# EAGLE design B130 (EAGLE 6.6.0)
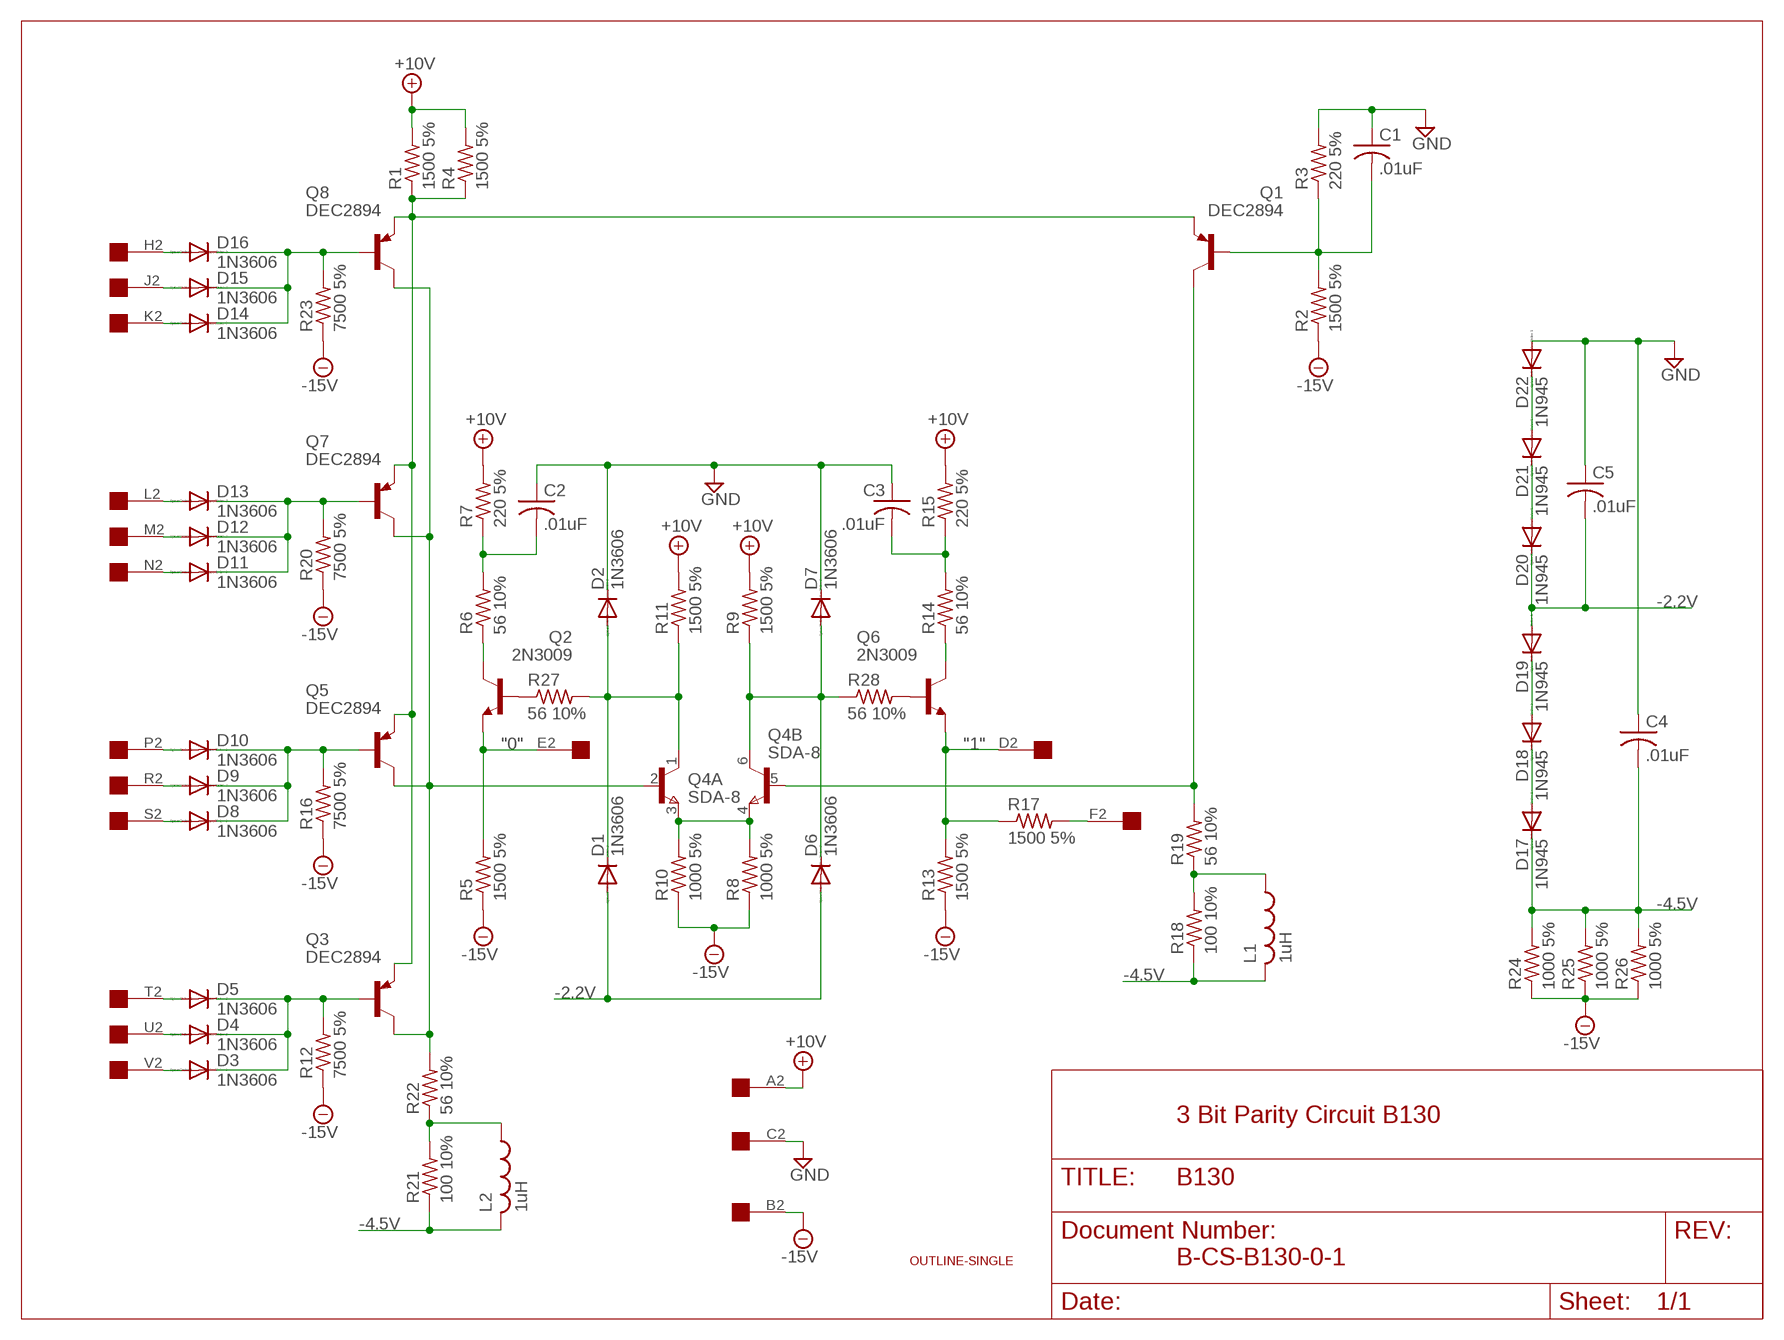
[diagram p0: schematic, sheet 1]

## Parts
C1  .01uF  C-US050-025X075  [C050-025X075]
C2  .01uF  C-US050-025X075  [C050-025X075]
C3  .01uF  C-US050-025X075  [C050-025X075]
C4  .01uF  C-US050-025X075  [C050-025X075]
C5  .01uF  C-US050-025X075  [C050-025X075]
D1  1N3606  1N4148DO35-10  [DO35-10]
D2  1N3606  1N4148DO35-10  [DO35-10]
D3  1N3606  1N4148DO35-10  [DO35-10]
D4  1N3606  1N4148DO35-10  [DO35-10]
D5  1N3606  1N4148DO35-10  [DO35-10]
D6  1N3606  1N4148DO35-10  [DO35-10]
D7  1N3606  1N4148DO35-10  [DO35-10]
D8  1N3606  1N4148DO35-10  [DO35-10]
D9  1N3606  1N4148DO35-10  [DO35-10]
D10  1N3606  1N4148DO35-10  [DO35-10]
D11  1N3606  1N4148DO35-10  [DO35-10]
D12  1N3606  1N4148DO35-10  [DO35-10]
D13  1N3606  1N4148DO35-10  [DO35-10]
D14  1N3606  1N4148DO35-10  [DO35-10]
D15  1N3606  1N4148DO35-10  [DO35-10]
D16  1N3606  1N4148DO35-10  [DO35-10]
D17  1N945  1N4148DO35-10  [DO35-10]
D18  1N945  1N4148DO35-10  [DO35-10]
D19  1N945  1N4148DO35-10  [DO35-10]
D20  1N945  1N4148DO35-10  [DO35-10]
D21  1N945  1N4148DO35-10  [DO35-10]
D22  1N945  1N4148DO35-10  [DO35-10]
L1  1uH  L-US0207/10  [0207/10]
L2  1uH  L-US0207/10  [0207/10]
Q1  DEC2894  2N2904  [TO39]
Q2  2N3009  2N2102  [TO5]
Q3  DEC2894  2N2904  [TO39]
Q4  SDA-8  MAT-02H  [TO78]
Q5  DEC2894  2N2904  [TO39]
Q6  2N3009  2N2102  [TO5]
Q7  DEC2894  2N2904  [TO39]
Q8  DEC2894  2N2904  [TO39]
R1  1500 5%  R-US_0207/10  [0207/10]
R2  1500 5%  R-US_0207/10  [0207/10]
R3  220 5%  R-US_0207/10  [0207/10]
R4  1500 5%  R-US_0207/10  [0207/10]
R5  1500 5%  R-US_0207/10  [0207/10]
R6  56 10%  R-US_0207/10  [0207/10]
R7  220 5%  R-US_0207/10  [0207/10]
R8  1000 5%  R-US_0207/10  [0207/10]
R9  1500 5%  R-US_0207/10  [0207/10]
R10  1000 5%  R-US_0207/10  [0207/10]
R11  1500 5%  R-US_0207/10  [0207/10]
R12  7500 5%  R-US_0207/10  [0207/10]
R13  1500 5%  R-US_0207/10  [0207/10]
R14  56 10%  R-US_0207/10  [0207/10]
R15  220 5%  R-US_0207/10  [0207/10]
R16  7500 5%  R-US_0207/10  [0207/10]
R17  1500 5%  R-US_0207/10  [0207/10]
R18  100 10%  R-US_0207/10  [0207/10]
R19  56 10%  R-US_0207/10  [0207/10]
R20  7500 5%  R-US_0207/10  [0207/10]
R21  100 10%  R-US_0207/10  [0207/10]
R22  56 10%  R-US_0207/10  [0207/10]
R23  7500 5%  R-US_0207/10  [0207/10]
R24  1000 5%  R-US_0207/10  [0207/10]
R25  1000 5%  R-US_0207/10  [0207/10]
R26  1000 5%  R-US_0207/10  [0207/10]
R27  56 10%  R-US_0207/10  [0207/10]
R28  56 10%  R-US_0207/10  [0207/10]
U$1  OUTLINE-SINGLE  [SINGLE]
U$2  EDGE-1  [EDGE-CON1]

## Nets
"0": Q2.1(E) R5.2 U$2.E2
"1": Q6.1(E) R13.2 R17.1 U$2.D2
+10V: R1.2 R4.2 R7.2 R9.2 R11.2 R15.2 U$2.A2
-2.2V: C5.2 D1.A D6.A D19.A D20.C
-4.5V: C4.2 D17.C L1.2 L2.2 R18.1 R21.1 R24.2 R25.2 R26.2
-15V: R2.1 R5.1 R8.1 R10.1 R12.1 R13.1 R16.1 R20.1 R23.1 R24.1 R25.1 R26.1 U$2.B2
GND [Supply]: C1.1 C2.1 C3.1 C4.1 C5.1 D2.C D7.C D22.A R3.2 U$2.C2
N$1: D16.A U$2.H2
N$2: D18.A D19.C
N$3: D15.A U$2.J2
N$4: D17.A D18.C
N$5: Q1.1(E) Q3.1(E) Q5.1(E) Q7.1(E) Q8.1(E) R1.1 R4.1
N$6: D14.A U$2.K2
N$7: D14.C D15.C D16.C Q8.2(B) R23.2
N$8: D13.A U$2.L2
N$9: D12.A U$2.M2
N$10: L2.1 R21.2 R22.1
N$11: D11.A U$2.N2
N$12: D11.C D12.C D13.C Q7.2(B) R20.2
N$13: D10.A U$2.P2
N$14: D9.A U$2.R2
N$15: D8.A U$2.S2
N$16: D8.C D9.C D10.C Q5.2(B) R16.2
N$17: D5.A U$2.T2
N$18: D4.A U$2.U2
N$19: D3.A U$2.V2
N$20: D3.C D4.C D5.C Q3.2(B) R12.2
N$21: Q3.3(C) Q4.2(A:B) Q5.3(C) Q7.3(C) Q8.3(C) R22.2
N$22: Q4.3(A:E) Q4.4(B:E) R8.2 R10.2
N$23: D1.C D2.A Q4.1(A:C) R11.1 R27.2
N$24: D6.C D7.A Q4.6(B:C) R9.1 R28.1
N$25: Q2.2(B) R27.1
N$26: D21.A D22.C
N$27: D20.A D21.C
N$28: Q6.2(B) R28.2
N$29: Q1.3(C) Q4.5(B:B) R19.2
N$30: C1.2 Q1.2(B) R2.2 R3.1
N$31: R17.2 U$2.F2
N$32: Q6.3(C) R14.1
N$33: Q2.3(C) R6.1
N$34: C2.2 R6.2 R7.1
N$35: C3.2 R14.2 R15.1
N$36: L1.1 R18.2 R19.1

## Notes on the sheet
- 3 Bit Parity Circuit B130
- B-CS-B130-0-1

## Library data of the parts
C1-C5 = rcl:C-US: CAPACITOR, American symbol
D1-D22 = diode:1N4148: DIODE high speed (Philips)
L1 L2 = rcl:L-US: INDUCTOR, American symbol
Q1 Q3 Q5 Q7 Q8 = transistor-pnp:2N2904*: PNP Transistror
Q2 Q6 = transistor-npn:2N2102: NPN Transistor
Q4 = linear:MAT-02H: Dual TRANSISTOR
R1-R28 = rcl:R-US_: RESISTOR, American symbol
U$1 = dec-con:OUTLINE-*: Board outlines for DEC boards.
U$2 = dec-con:EDGE-1: Single-Sided DEC Edge Connector -- (side 2)

## Net classes
1 Supply: width 0.813 mm

## Board
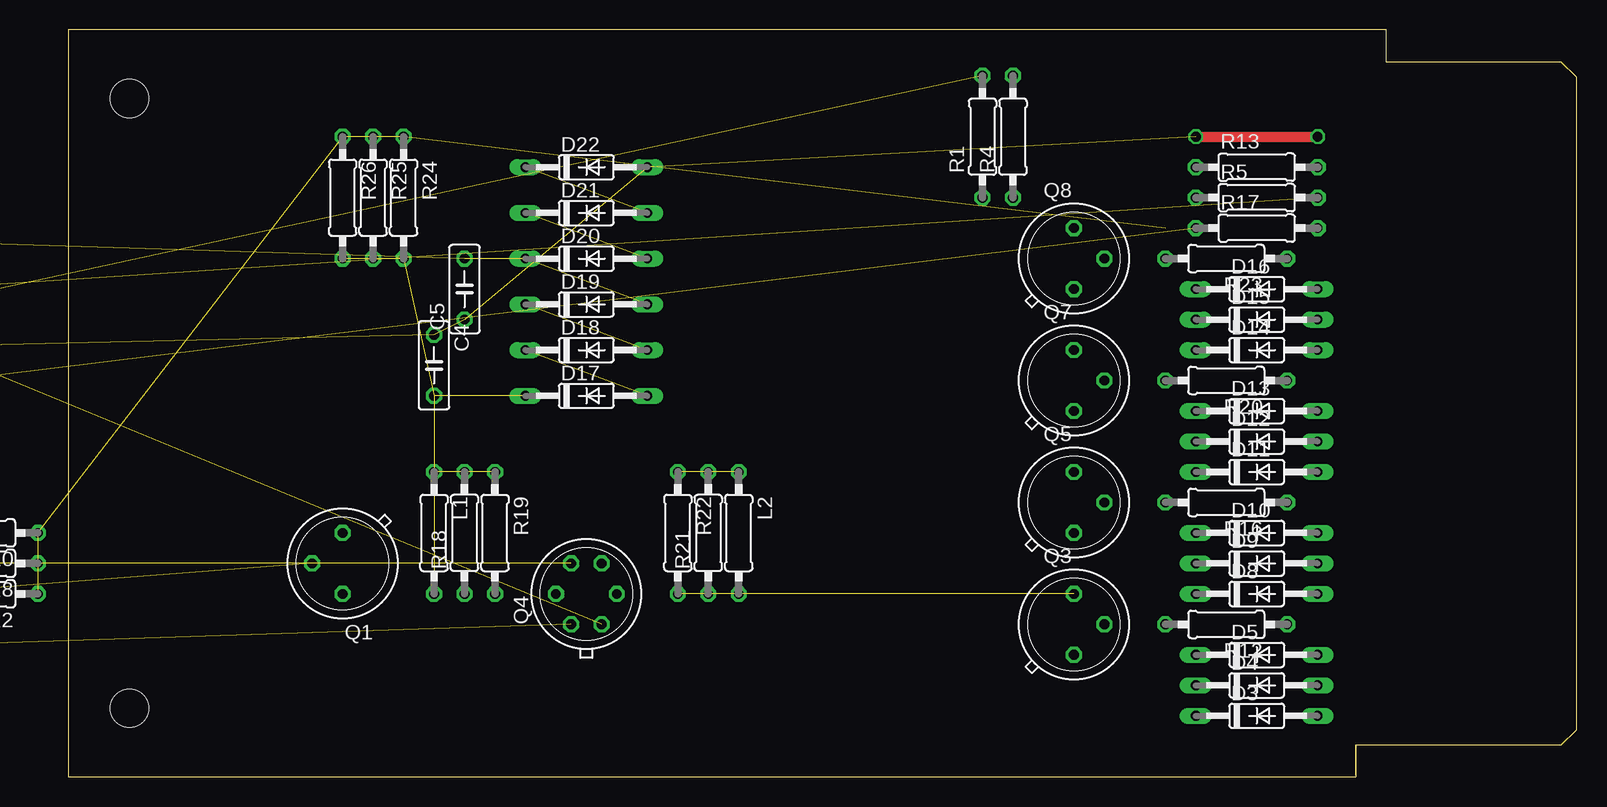
[diagram p1: board, top side]
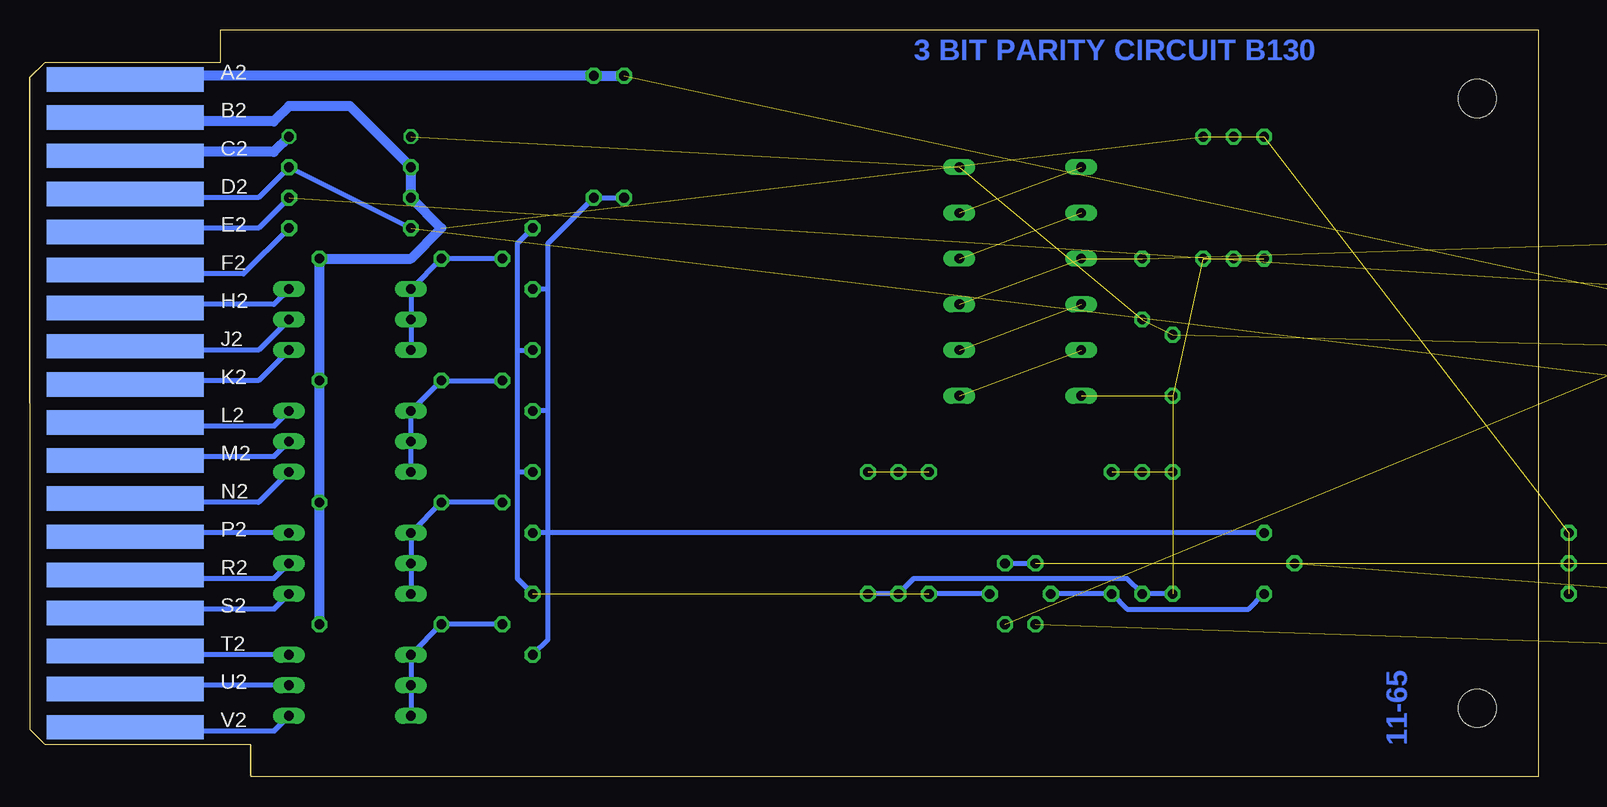
[diagram p2: board, bottom side, seen from below]

Size 125.73 x 62.23 mm. Coordinates in mm from the lower left corner, seen from the top.
Copper layers (1+16): Top 0.035mm / dielectric 1.5mm / Bottom 0.035mm
Design rules "16mils": minimum track width 16mil, minimum drill 32mil, track to track 15mil, track to pad 10mil, pad to pad 10mil, via to via 10mil, smd to smd 10mil, copper to edge 25mil, drill to drill 10mil, minimum pad ring 10mil, minimum via ring 8mil, stop-mask expansion 0mil, vias tented up to drill 0mil, thermal gap 10mil

### Footprints (pad centres in the part's own frame; a part is rotated, then mirrored left to right if it is on the bottom)
C050-025X075 = drill 0.813 octagon: 1 -2.54,0; 2 2.54,0
DO35-10 = drill 0.813 long: A 5.08,0; C -5.08,0
0207/10 = drill 0.813 octagon: 1 -5.08,0; 2 5.08,0
TO39 = drill 0.813 octagon: 1 0,-2.54; 2 2.54,0; 3 0,2.54
TO5 = drill 0.813 octagon: 1 0,-2.54; 2 2.54,0; 3 0,2.54
TO78 = drill 0.813 octagon: 1 -2.54,-1.27; 2 0,-2.54; 3 2.54,-1.27; 4 2.54,1.27; 5 0,2.54; 6 -2.54,1.27
SINGLE = hole 3.175: 120.65,56.515; 120.65,5.715
EDGE-CON1 = smd 13.106 x 2.032 bottom: A2 7.938,4.128; B2 7.938,7.303; C2 7.938,10.477; D2 7.938,13.652; E2 7.938,16.828; F2 7.938,20.003; H2 7.938,23.177; J2 7.938,26.352; K2 7.938,29.527; L2 7.938,32.703; M2 7.938,35.877; N2 7.938,39.053; P2 7.938,42.227; R2 7.938,45.403; S2 7.938,48.578; T2 7.938,51.752; U2 7.938,54.928; V2 7.938,58.102

### Placement (x,y rotation side)
C1  -22.86,17.78 0 top  (outside the outline)
C2  -27.94,35.56 180 top  (outside the outline)
C3  -27.94,25.4 180 top  (outside the outline)
C4  30.48,34.29 270 top
C5  33.02,40.64 90 top
D1  -43.18,45.72 180 top  (outside the outline)
D2  -30.48,45.72 180 top  (outside the outline)
D3  99.06,5.08 0 top
D4  99.06,7.62 0 top
D5  99.06,10.16 0 top
D6  -43.18,10.16 180 top  (outside the outline)
D7  -30.48,10.16 180 top  (outside the outline)
D8  99.06,15.24 0 top
D9  99.06,17.78 0 top
D10  99.06,20.32 0 top
D11  99.06,25.4 0 top
D12  99.06,27.94 0 top
D13  99.06,30.48 0 top
D14  99.06,35.56 0 top
D15  99.06,38.1 0 top
D16  99.06,40.64 0 top
D17  43.18,31.75 0 top
D18  43.18,35.56 0 top
D19  43.18,39.37 0 top
D20  43.18,43.18 0 top
D21  43.18,46.99 0 top
D22  43.18,50.8 0 top
L1  30.48,20.32 270 top
L2  55.88,20.32 270 top
Q1  22.86,17.78 180 top
Q2  -48.26,38.1 270 top  (outside the outline)
Q3  83.82,12.7 0 top
Q4  43.18,15.24 90 top
Q5  83.82,22.86 0 top
Q6  -48.26,27.94 270 top  (outside the outline)
Q7  83.82,33.02 0 top
Q8  83.82,43.18 0 top
R1  76.2,53.34 90 top
R2  -7.62,15.24 180 top
R3  -20.32,15.24 180 top  (outside the outline)
R4  78.74,53.34 90 top
R5  99.06,48.26 0 top
R6  -35.56,38.1 0 top  (outside the outline)
R7  -22.86,38.1 0 top  (outside the outline)
R8  -7.62,17.78 180 top
R9  -30.48,7.62 0 top  (outside the outline)
R10  -7.62,20.32 180 top
R11  -30.48,48.26 0 top  (outside the outline)
R12  96.52,12.7 180 top
R13  99.06,50.8 0 top
R14  -35.56,27.94 0 top  (outside the outline)
R15  -22.86,27.94 0 top  (outside the outline)
R16  96.52,22.86 180 top
R17  99.06,45.72 0 top
R18  33.02,20.32 90 top
R19  35.56,20.32 270 top
R20  96.52,33.02 180 top
R21  53.34,20.32 90 top
R22  50.8,20.32 270 top
R23  96.52,43.18 180 top
R24  27.94,48.26 270 top
R25  25.4,48.26 270 top
R26  22.86,48.26 270 top
R27  -43.18,48.26 0 top  (outside the outline)
R28  -43.18,7.62 180 top  (outside the outline)
U$1  125.73,62.23 180 top
U$2  125.73,62.23 180 top

### Tracks (layer width: path | path; a pad name or v marks a point on that pad's centre or on a via)
"0"  (1 unrouted)
  Bottom 0.406: U$2.E2 117.17,45.39 116.84,45.72 106.68,45.72 R5.2
"1"  (1 unrouted)
  Bottom 0.406: R17.1 R13.2 106.68,48.26 116.84,48.26 117.14,48.56 U$2.D2
+10V  (4 unrouted)
  Bottom 0.813: U$2.A2 117.22,58.04 116.84,58.42 R4.2 R1.2
-2.2V  (4 unrouted)
-4.5V  (5 unrouted)
  Bottom 0.406: L1.2 R18.1 34.29,16.51 52.07,16.51 R21.1 L2.2
-15V  (6 unrouted)
  Bottom 0.813: U$2.B2 117.13,54.9 116.84,54.61 105.41,54.61 104.14,55.88 99.06,55.88 R13.1 R5.1 91.44,45.72 93.98,43.18 R23.1 R20.1 R16.1 R12.1
GND  (via drill 0.81)  (9 unrouted)
  Top 0.813: v93.98,53.34 v104.14,53.34
  Bottom 0.813: U$2.C2 117.17,51.74 116.84,52.07 105.41,52.07 v104.14,53.34
N$1
  Bottom 0.406: U$2.H2 117.17,39.04 116.84,39.37 105.41,39.37 D16.A
N$2  (1 unrouted)
N$3
  Bottom 0.406: U$2.J2 117.17,35.89 116.84,35.56 106.68,35.56 D15.A
N$4  (1 unrouted)
N$5
  Bottom 0.406: R1.1 R4.1 82.55,44.45 82.55,40.64 | 82.55,40.64 Q8.1 | Q3.1 82.55,11.43 82.55,20.32 | 82.55,20.32 82.55,30.48 | 82.55,30.48 82.55,40.64 | 82.55,30.48 Q7.1 | 82.55,20.32 Q5.1 | Q1.1 82.55,20.32
N$6
  Bottom 0.406: U$2.K2 117.14,32.72 116.84,33.02 106.68,33.02 D14.A
N$7
  Bottom 0.406: Q8.2 R23.2 D16.C D15.C D14.C
N$8
  Bottom 0.406: U$2.L2 117.17,29.54 116.84,29.21 105.41,29.21 D13.A
N$9
  Bottom 0.406: U$2.M2 117.17,26.34 116.84,26.67 105.41,26.67 D12.A
N$10  (2 unrouted)
N$11
  Bottom 0.406: U$2.N2 117.17,23.19 116.84,22.86 106.68,22.86 D11.A
N$12
  Bottom 0.406: Q7.2 R20.2 D13.C D12.C D11.C
N$13
  Bottom 0.406: U$2.P2 117.17,19.99 116.84,20.32 D10.A
N$14
  Bottom 0.406: U$2.R2 117.17,16.84 116.84,16.51 105.41,16.51 D9.A
N$15
  Bottom 0.406: U$2.S2 117.14,13.66 116.84,13.97 105.41,13.97 D8.A
N$16
  Bottom 0.406: D8.C D9.C D10.C R16.2 Q5.2
N$17
  Bottom 0.406: U$2.T2 117.17,10.49 116.84,10.16 D5.A
N$18
  Bottom 0.406: U$2.U2 117.2,7.26 116.84,7.62 D4.A
N$19
  Bottom 0.406: U$2.V2 117.16,4.13 116.84,3.81 105.41,3.81 D3.A
N$20
  Bottom 0.406: Q3.2 R12.2 D5.C D4.C D3.C
N$21  (1 unrouted)
  Bottom 0.406: Q8.3 85.09,44.45 85.09,35.56 | 85.09,25.4 85.09,16.51 Q3.3 | 85.09,25.4 85.09,35.56 | 85.09,25.4 Q5.3 | 85.09,35.56 Q7.3 | Q4.2 R22.2
N$22  (2 unrouted)
  Bottom 0.406: Q4.3 Q4.4
N$23  (4 unrouted)
N$24  (4 unrouted)
N$25  (1 unrouted)
N$26  (1 unrouted)
N$27  (1 unrouted)
N$28  (1 unrouted)
N$29
  Bottom 0.406: Q4.5 R19.2 34.29,13.97 24.13,13.97 Q1.3
N$30  (3 unrouted)
N$31
  Bottom 0.406: U$2.F2 117.12,42.19 116.84,41.91 107.95,41.91 R17.2
N$32  (1 unrouted)
N$33  (1 unrouted)
N$34  (2 unrouted)
N$35  (2 unrouted)
N$36  (2 unrouted)

### Text on the board
Bottom: 3 BIT PARITY CIRCUIT B130 | 11-65